# Altium schematic sheet Power.SchDoc
size A3; SheetNumber: 8; SheetTotal: 10
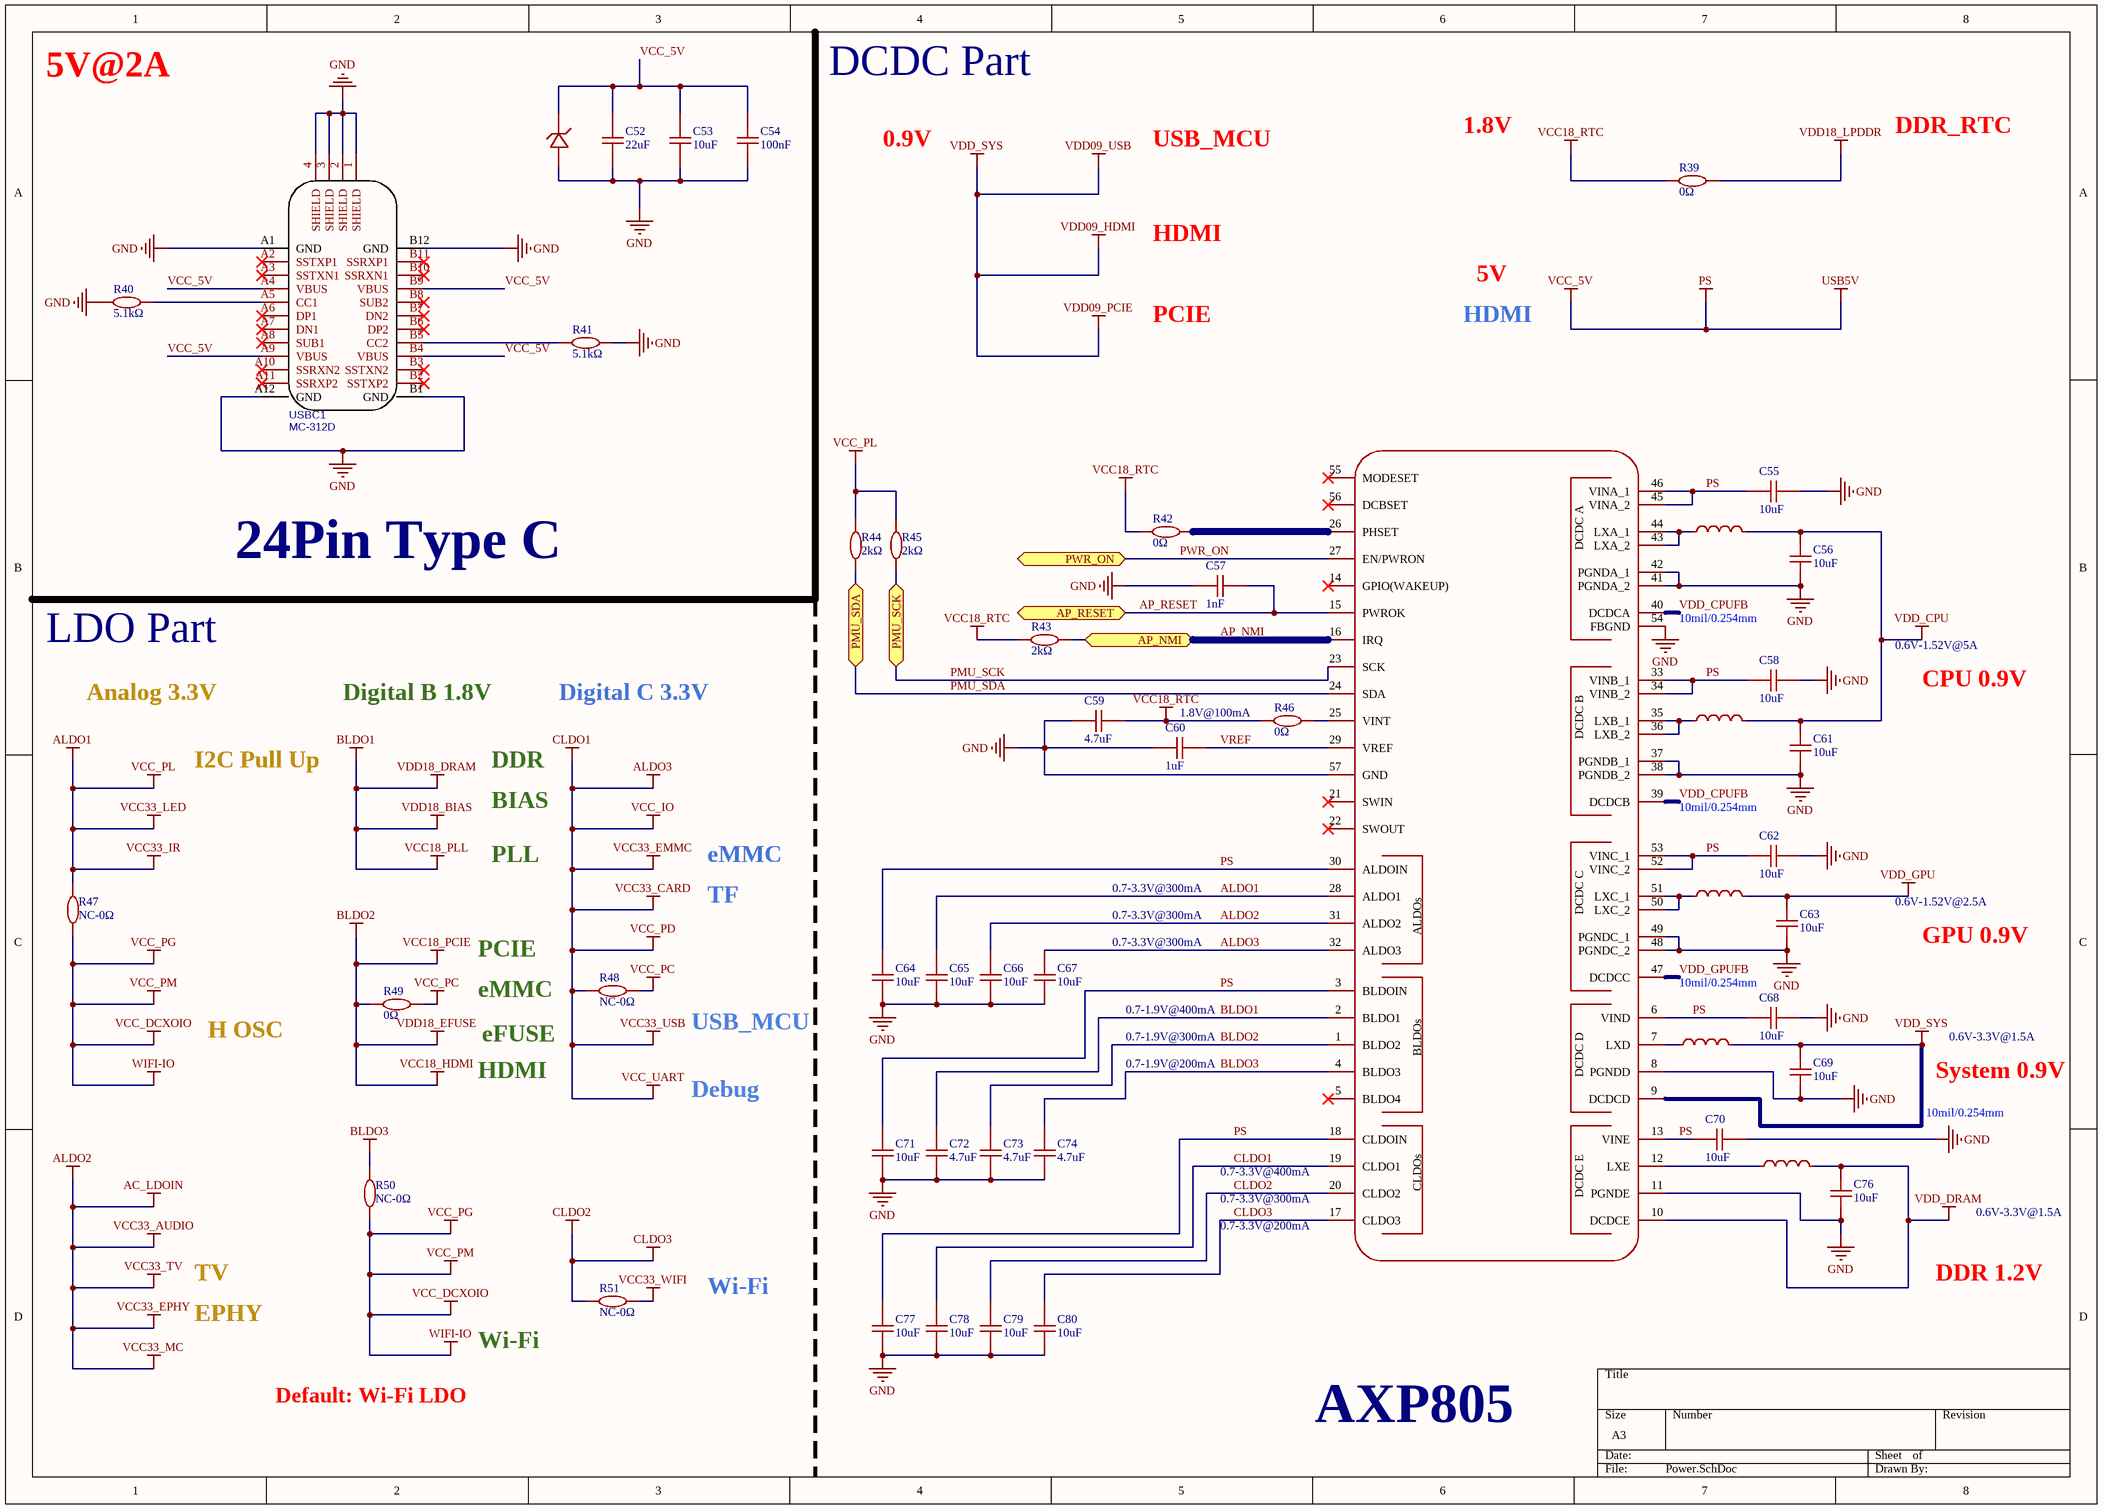
[diagram p0: Power.SchDoc]

## Parts
C52  22uF  [C0603]
C53  10uF  [C0603]
C54  100nF  [C0402]
C55  10uF  [C0603]
C56  10uF  [C0603]
C57  1nF  [C0402]
C58  10uF  [C0603]
C59  4.7uF  [C0402]
C60  1uF  [C0402]
C61  10uF  [C0603]
C62  10uF  [C0603]
C63  10uF  [C0603]
C64  10uF  [C0603]
C65  10uF  [C0603]
C66  10uF  [C0603]
C67  10uF  [C0603]
C68  10uF  [C0603]
C69  10uF  [C0603]
C70  10uF  [C0603]
C71  10uF  [C0603]
C72  4.7uF  [C0402]
C73  4.7uF  [C0402]
C74  4.7uF  [C0402]
C76  10uF  [C0603]
C77  10uF  [C0603]
C78  10uF  [C0603]
C79  10uF  [C0603]
C80  10uF  [C0603]
D5  SMAJ5.0A  [SMA_L4.3-W2.6-LS5.2-RD]  (value not drawn)
L2  1.5uH  [IND-SMD_L4.0-W4.0]  (value not drawn)
L3  1.5uH  [IND-SMD_L4.0-W4.0]  (value not drawn)
L4  1.5uH  [IND-SMD_L4.0-W4.0]  (value not drawn)
L5  1.5uH  [IND-SMD_L4.0-W4.0]  (value not drawn)
L6  1.5uH  [IND-SMD_L4.0-W4.0]  (value not drawn)
R39  0Ω  [R0402]
R40  5.1kΩ  [R0402]
R41  5.1kΩ  [R0402]
R42  0Ω  [R0402]
R43  2kΩ  [R0402]
R44  2kΩ  [R0402]
R45  2kΩ  [R0402]
R46  0Ω  [R0402]
R47  NC-0Ω  [R0402]
R48  NC-0Ω  [R0402]
R49  0Ω  [R0402]
R50  NC-0Ω  [R0402]
R51  NC-0Ω  [R0402]
U4  AXP805  [QFN-56_L7.0-W7.0-P0.40-TL-EP4.6]  (value not drawn)
USBC1  MC-312D  [USB-C-SMD_MC-312D-C]

## Ports
AP_NMI (bidir), AP_RESET (bidir, see GPIO[6C], SoC_2[4A]), PMU_SCK (bidir, see SoC_1[6C]), PMU_SDA (bidir, see SoC_1[6C]), PWR_ON (bidir, see GPIO[5C])

## Nets
ALDO1: C65.2 R44.2 R45.2 R47.2 U4.28(ALDO1)  [also labelled VCC33_IR, VCC33_LED, VCC_PL]
ALDO2: C66.2 U4.31(ALDO2)  [also labelled AC_LDOIN, VCC33_AUDIO, VCC33_EPHY, VCC33_MC, VCC33_TV]
ALDO3: C67.2 C78.2 R48.2 U4.19(CLDO1) U4.32(ALDO3)  [also labelled CLDO1, VCC33_CARD, VCC33_EMMC, VCC33_USB, VCC_IO, VCC_PD, VCC_UART]
BLDO1: C72.2 U4.2(BLDO1)  [also labelled VCC18_PLL, VDD18_BIAS, VDD18_DRAM]
BLDO2: C73.2 R49.1 U4.1(BLDO2)  [also labelled VCC18_HDMI, VCC18_PCIE, VDD18_EFUSE]
BLDO3: C74.2 R50.2 U4.4(BLDO3)
CLDO2: C79.2 C80.2 R51.2 U4.17(CLDO3) U4.20(CLDO2)  [also labelled CLDO3]
GND: C52.1 C53.1 C54.1 C55.1 C56.1 C57.1 C58.1 C59.1 C60.1 C61.1 C62.1 C63.1 C64.1 C65.1 C66.1 C67.1 C68.1 C69.1 C70.1 C71.1 C72.1 C73.1 C74.1 C76.1 C77.1 C78.1 C79.1 C80.1 D5.2(A) R40.1 R41.2 U4.8(PGNDD) U4.11(PGNDE) U4.37(PGNDB_1) U4.38(PGNDB_2) U4.41(PGNDA_2) U4.42(PGNDA_1) U4.48(PGNDC_2) U4.49(PGNDC_1) U4.54(FBGND) U4.57(GND) USBC1.1(SHIELD) USBC1.2(SHIELD) USBC1.3(SHIELD) USBC1.4(SHIELD) USBC1.A1(GND) USBC1.A12(GND) USBC1.B1(GND) USBC1.B12(GND)
PS: C52.2 C53.2 C54.2 C55.2 C58.2 C62.2 C64.2 C68.2 C70.2 C71.2 C77.2 D5.1(C) U4.3(BLDOIN) U4.6(VIND) U4.13(VINE) U4.18(CLDOIN) U4.30(ALDOIN) U4.33(VINB_1) U4.34(VINB_2) U4.45(VINA_2) U4.46(VINA_1) U4.52(VINC_2) U4.53(VINC_1) USBC1.A4(VBUS) USBC1.A9(VBUS) USBC1.B4(VBUS) USBC1.B9(VBUS)  [also labelled USB5V, VCC_5V]
VCC18_RTC: C59.2 R39.1 R42.1 R43.1 R46.1
VCC33_WIFI: R51.1
VCC_DCXOIO: R47.1 R50.1  [also labelled VCC_PG, VCC_PM, WIFI-IO]
VCC_PC: R48.1 R49.2
VDD09_HDMI: C69.2 L5.2 U4.9(DCDCD)  [also labelled VDD09_PCIE, VDD09_USB, VDD_SYS]
VDD18_LPDDR: R39.2
VDD_CPU: C56.2 C61.2 L2.2 L3.2
VDD_DRAM: C76.2 L6.2 U4.10(DCDCE)
VDD_GPU: C63.2 L4.2
AP_NMI: R43.2 U4.16(IRQ) ; port AP_NMI
AP_RESET: C57.2 U4.15(PWROK) ; port AP_RESET
PMU_SCK: R45.1 U4.23(SCK) ; port PMU_SCK
PMU_SDA: R44.1 U4.24(SDA) ; port PMU_SDA
PWR_ON: U4.27(EN/PWRON) ; port PWR_ON
VDD_CPUFB: U4.39(DCDCB) U4.40(DCDCA)
VDD_GPUFB: U4.47(DCDCC)
VREF: C60.2 U4.29(VREF)
NetL2_1: L2.1 U4.43(LXA_2) U4.44(LXA_1)
NetL3_1: L3.1 U4.35(LXB_1) U4.36(LXB_2)
NetL4_1: L4.1 U4.50(LXC_2) U4.51(LXC_1)
NetL5_1: L5.1 U4.7(LXD)
NetL6_1: L6.1 U4.12(LXE)
NetR40_2: R40.2 USBC1.A5(CC1)
NetR41_1: R41.1 USBC1.B5(CC2)
NetR42_2: R42.2 U4.26(PHSET)
NetR46_2: R46.2 U4.25(VINT)

Not connected (* = marked no-connect by the designer): U4 5(BLDO4)* 14(GPIO(WAKEUP))* 21(SWIN)* 22(SWOUT)* 55(MODESET)* 56(DCBSET)*; USBC1 A2(SSTXP1)* A3(SSTXN1)* A6(DP1)* A7(DN1)* A8(SUB1)* A10(SSRXN2)* A11(SSRXP2)* B2(SSTXP2)* B3(SSTXN2)* B6(DP2)* B7(DN2)* B8(SUB2)* B10(SSRXN1)* B11(SSRXP1)*

## Notes on the sheet
- 5V@2A
- DCDC Part
- 0.9V
- USB_MCU
- 1.8V
- DDR_RTC
- HDMI
- 5V
- PCIE
- 24Pin Type C
- LDO Part
- 10mil/0.254mm
- 0.6V-1.52V@5A
- Analog 3.3V
- Digital B 1.8V
- Digital C 3.3V
- 1.8V@100mA
- CPU 0.9V
- I2C Pull Up
- DDR
- BIAS
- PLL
- eMMC
- TF
- 0.7-3.3V@300mA
- 0.6V-1.52V@2.5A
- GPU 0.9V
- H OSC
- eFUSE
- 0.7-1.9V@400mA
- 0.7-1.9V@300mA
- 0.6V-3.3V@1.5A
- Debug
- 0.7-1.9V@200mA
- System 0.9V
- (near U4) 0.7-3.3V@400mA
- (near U4) 0.7-3.3V@300mA
- (near U4) 0.7-3.3V@200mA
- TV
- EPHY
- Wi-Fi
- DDR 1.2V
- Default: Wi-Fi LDO
- AXP805
- (in symbol AXP805) DCDC A; DCDC B; DCDC C; ALDOs; BLDOs; DCDC D; CLDOs; DCDC E

## Library data of the parts
C52 = 22uF: 16V 22uF X5R ±20% 0603 Ceramic Capacitors ROHS
C53 C55 C56 C58 C61-C71 C76-C80 = 10uF: 10V 10uF X5R ±10% 0603 Ceramic Capacitors ROHS
C54 = 100nF: 50V 100nF X7R ±10% 0402 Ceramic Capacitors ROHS
C57 = 1nF: 50V 1nF X7R ±10% 0402 Ceramic Capacitors ROHS
C59 C72-C74 = 4.7uF: 10V 4.7uF X5R ±20% 0402 Ceramic Capacitors ROHS
C60 = 1uF: 50V 1uF X5R ±10% 0402 Ceramic Capacitors ROHS
D5 = SMAJ5.0A_C83329: 43.5A 400W 9.2V 6.4V Unidirectional 5V DO-214AC(SMA) TVS Diodes ROHS; Manufacturer: Littelfuse(美国力特); Symbol: SMAJ5.0A-C83329; Add into BOM: yes; Reverse Leakage Current (Ir): 800uA; Device: SMAJ5.0A_C83329; LCSC Part Name: 耐压/V 5V-440V 峰值脉冲功率 400W; Supplier Part: C83329; Manufacturer Part: SMAJ5.0A; Supplier Footprint: DO-214AC(SMA); JLCPCB Part Class: Extended Part; Datasheet: https://item.szlcsc.com/datasheet/SMAJ5.0A/84493.html; Supplier: LCSC; Convert to PCB: yes; Polarity: Unidirectional; Reverse Stand-Off Voltage (Vrwm): 5V; Clamping Voltage: 9.2V; Peak Pulse Current (Ipp): 43.5A; Peak Pulse Power Dissipation (Ppp): 400W; Voltage - Breakdown: 6.4V; Operating Temperature: -65℃~+150℃; Type: TVS
L2-L6 = SLW4030S1R5NST: 4.15A 1.5uH ±30% 18mΩ SMD,4x4mm Fixed Inductors ROHS; Manufacturer: Sunltech(顺磁); Symbol: SLW4030S1R0NST; Add into BOM: yes; Value: 1uH; Device: SLW4030S1R0NST; LCSC Part Name: 1uH ±30%; Supplier Part: C206354; Manufacturer Part: SLW4030S1R0NST; Supplier Footprint: SMD,4x4mm; JLCPCB Part Class: Extended Part; Datasheet: https://item.szlcsc.com/datasheet/SLW4030S1R0NST/207399.html; Supplier: LCSC; Convert to PCB: yes; Tolerance: ±30%; Current Rating: 4.15A; DC Resistance(DCR): 18mΩ
R39 R42 R46-R51 = 0Ω: 0Ω 62.5mW 50V Thick Film Resistor ±1% 0402 Chip Resistor - Surface Mount ROHS
R40 R41 = 5.1kΩ: 5.1kΩ 62.5mW 50V ±100ppm/℃ Thick Film Resistor ±1% 0402 Chip Resistor - Surface Mount ROHS
R43-R45 = 2kΩ: 100mW 2kΩ 75V ±100ppm/℃ Thick Film Resistor ±1% 0402 Chip Resistor - Surface Mount ROHS
U4 = AXP805: Add into BOM: yes; Symbol: AXP805; Device: AXP805; Convert to PCB: yes
USBC1 = MC-312D: 1 24P Type-C SMD USB, DVI, HDMI Connector Assemblies ROHS; Manufacturer: SOFNG(硕方); Manufacturer Part: MC-312D-C; Contributor: LCSC; Supplier: LCSC; Supplier Part: C183607; JLCPCB Part Class: Extended Part; spicePre: U; spiceSymbolName: MC-312D